# EAGLE schematic AD75019 breakout (EAGLE 8.3.1)
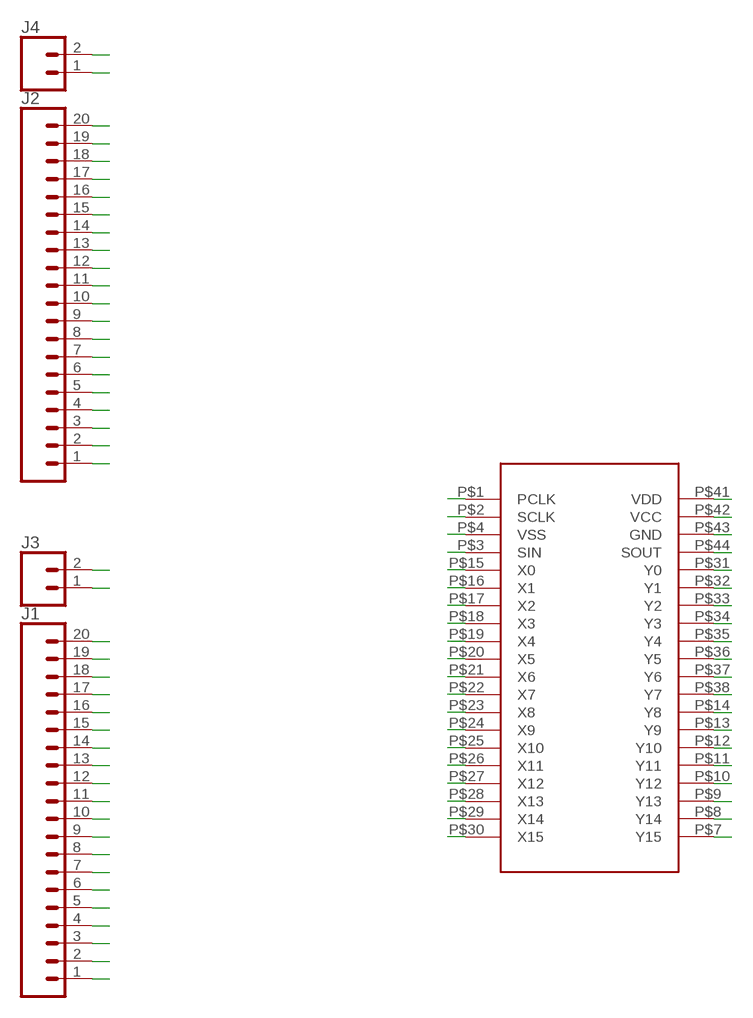
[diagram p0: schematic, sheet 1]

## Parts
J1  CONN_20  [1X20]
J2  CONN_20  [1X20]
J3  CONN_02  [1X02]
J4  CONN_02  [1X02]
U$1  AD75019DIP44  [DIP44]

## Nets
1: J1.1 U$1.P$1(PCLK)
2: J1.2 U$1.P$2(SCLK)
3: J1.3 U$1.P$3(SIN)
4: J1.4 U$1.P$4(VSS)
5: J1.5
6: J1.6
7: J1.7 U$1.P$7(Y15)
8: J1.8 U$1.P$8(Y14)
9: J1.9 U$1.P$9(Y13)
10: J1.10 U$1.P$10(Y12)
11: J1.11 U$1.P$11(Y11)
12: J1.12 U$1.P$12(Y10)
13: J1.13 U$1.P$13(Y9)
14: J1.14 U$1.P$14(Y8)
15: J1.15 U$1.P$15(X0)
16: J1.16 U$1.P$16(X1)
17: J1.17 U$1.P$17(X2)
18: J1.18 U$1.P$18(X3)
19: J1.19 U$1.P$19(X4)
20: J1.20 U$1.P$20(X5)
21: J3.1 U$1.P$21(X6)
22: J3.2 U$1.P$22(X7)
23: J2.1 U$1.P$23(X8)
24: J2.2 U$1.P$24(X9)
25: J2.3 U$1.P$25(X10)
26: J2.4 U$1.P$26(X11)
27: J2.5 U$1.P$27(X12)
28: J2.6 U$1.P$28(X13)
29: J2.7 U$1.P$29(X14)
30: J2.8 U$1.P$30(X15)
31: J2.9 U$1.P$31(Y0)
32: J2.10 U$1.P$32(Y1)
33: J2.11 U$1.P$33(Y2)
34: J2.12 U$1.P$34(Y3)
35: J2.13 U$1.P$35(Y4)
36: J2.14 U$1.P$36(Y5)
37: J2.15 U$1.P$37(Y6)
38: J2.16 U$1.P$38(Y7)
39: J2.17
40: J2.18
41: J2.19 U$1.P$41(VDD)
42: J2.20 U$1.P$42(VCC)
43: J4.1 U$1.P$43(GND)
44: J4.2 U$1.P$44(SOUT)

## Library data of the parts
J1 J2 = SparkFun-Connectors:CONN_20: Multi connection point. Often used as Generic Header-pin footprint for 0.1 inch spaced/style header connections On any of the 0.1 inch spaced packages, you can populate with these: Break Away Headers - Straight <https://www.sparkfun.com/products/116> (PRT-00116) Break Away Male Headers - Right Angle <https://www.sparkfun.com/products/553> (PRT-00553) Female Headers <https://www.sparkfun.com/products/115> (PRT-00115) Break Away Headers - Machine Pin <https://www.sparkfun.com/products/117> (PRT-00117) Break Away Female Headers - Swiss Machine Pin <https://www.sparkfun.com/products/743> (PRT-00743) For SCREWTERMINALS and SPRING TERMINALS visit here: Screw Terimnals on SparkFun.com <https://www.sparkfun.com/search/results?term=Screw+Terminals> (5mm/3.5mm/2.54mm spacing) This device is also useful as a general connection point to wire up your design to another part of your project. Our various solder wires solder well into these plated through hole pads. Hook-Up Wire - Assortment (Stranded, 22 AWG) <https://www.sparkfun.com/products/11375> (PRT-11375) Hook-Up Wire - Assortment (Solid Core, 22 AWG) <https://www.sparkfun.com/products/11367> (PRT-11367) View the entire wire category on our website here <https://www.sparkfun.com/categories/141> Special notes: Molex polarized connector foot print use with SKU : PRT-08231 with associated crimp pins and housings. 1MM SMD Version SKU: PRT-10208 NOTES ON THE VARIANTS LOCK and LOCK_LONGPADS... This footprint was designed to help hold the alignment of a through-hole component (i.e. 6-pin header) while soldering it into place. You may notice that each hole has been shifted either up or down by 0.005 of an inch from it's more standard position (which is a perfectly straight line). This slight alteration caused the pins (the squares in the middle) to touch the edges of the holes. Because they are alternating, it causes a "brace" to hold the component in place. 0.005 has proven to be the perfect amount of "off-center" position when using our standard breakaway headers. Although looks a little odd when you look at the bare footprint, once you have a header in there, the alteration is very hard to notice. Also,if you push a header all the way into place, it is covered up entirely on the bottom side. Note about LOCK SPECIAL package: This is just like the LOCK variant in that the holes are staggared by 5 mil, but except for the last two holes. They are not altered from the "standard" footprint layout. This is used for a special purpose on the layout of our Graphic LCD Backpack. Make sure you want to use this device before selecting it for you project!
J3 J4 = SparkFun-Connectors:CONN_02: Multi connection point. Often used as Generic Header-pin footprint for 0.1 inch spaced/style header connections On any of the 0.1 inch spaced packages, you can populate with these: Break Away Headers - Straight <https://www.sparkfun.com/products/116> (PRT-00116) Break Away Male Headers - Right Angle <https://www.sparkfun.com/products/553> (PRT-00553) Female Headers <https://www.sparkfun.com/products/115> (PRT-00115) Break Away Headers - Machine Pin <https://www.sparkfun.com/products/117> (PRT-00117) Break Away Female Headers - Swiss Machine Pin <https://www.sparkfun.com/products/743> (PRT-00743) For SCREWTERMINALS and SPRING TERMINALS visit here: Screw Terimnals on SparkFun.com <https://www.sparkfun.com/search/results?term=Screw+Terminals> (5mm/3.5mm/2.54mm spacing) This device is also useful as a general connection point to wire up your design to another part of your project. Our various solder wires solder well into these plated through hole pads. Hook-Up Wire - Assortment (Stranded, 22 AWG) <https://www.sparkfun.com/products/11375> (PRT-11375) Hook-Up Wire - Assortment (Solid Core, 22 AWG) <https://www.sparkfun.com/products/11367> (PRT-11367) View the entire wire category on our website here <https://www.sparkfun.com/categories/141> Special notes: Molex polarized connector foot print use with: PRT-08233 with associated crimp pins and housings. 2.54_SCREWTERM for use with PRT-10571. 3.5mm Screw Terminal footprints for PRT-08084 5mm Screw Terminal footprints for use with PRT-08432
U$1 = AD75019:AD75019